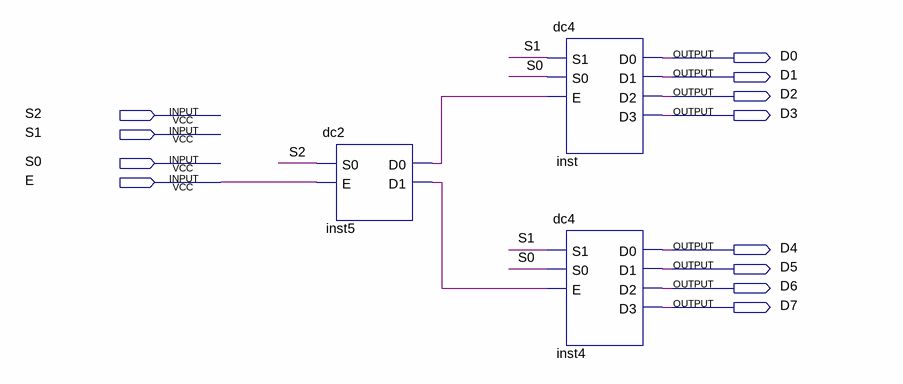
[diagram p0: schematic sheet]
// Quartus schematic dc8.bdf as structural Verilog: 3 symbols, 12 pins
module dc8 (
  input  S2,
  input  S1,
  input  S0,
  input  E,
  output D0,
  output D1,
  output D2,
  output D3,
  output D4,
  output D5,
  output D6,
  output D7
);

  wire inst5_d0, inst5_d1;

  dc2 inst5 (.S0(S2), .E(E), .D0(inst5_d0), .D1(inst5_d1));
  dc4 inst (.S1(S1), .S0(S0), .E(inst5_d0), .D0(D0), .D1(D1), .D2(D2), .D3(D3));
  dc4 inst4 (.S1(S1), .S0(S0), .E(inst5_d1), .D0(D4), .D1(D5), .D2(D6), .D3(D7));
endmodule
